# EAGLE schematic muscleSensor (EAGLE 7.2.0)
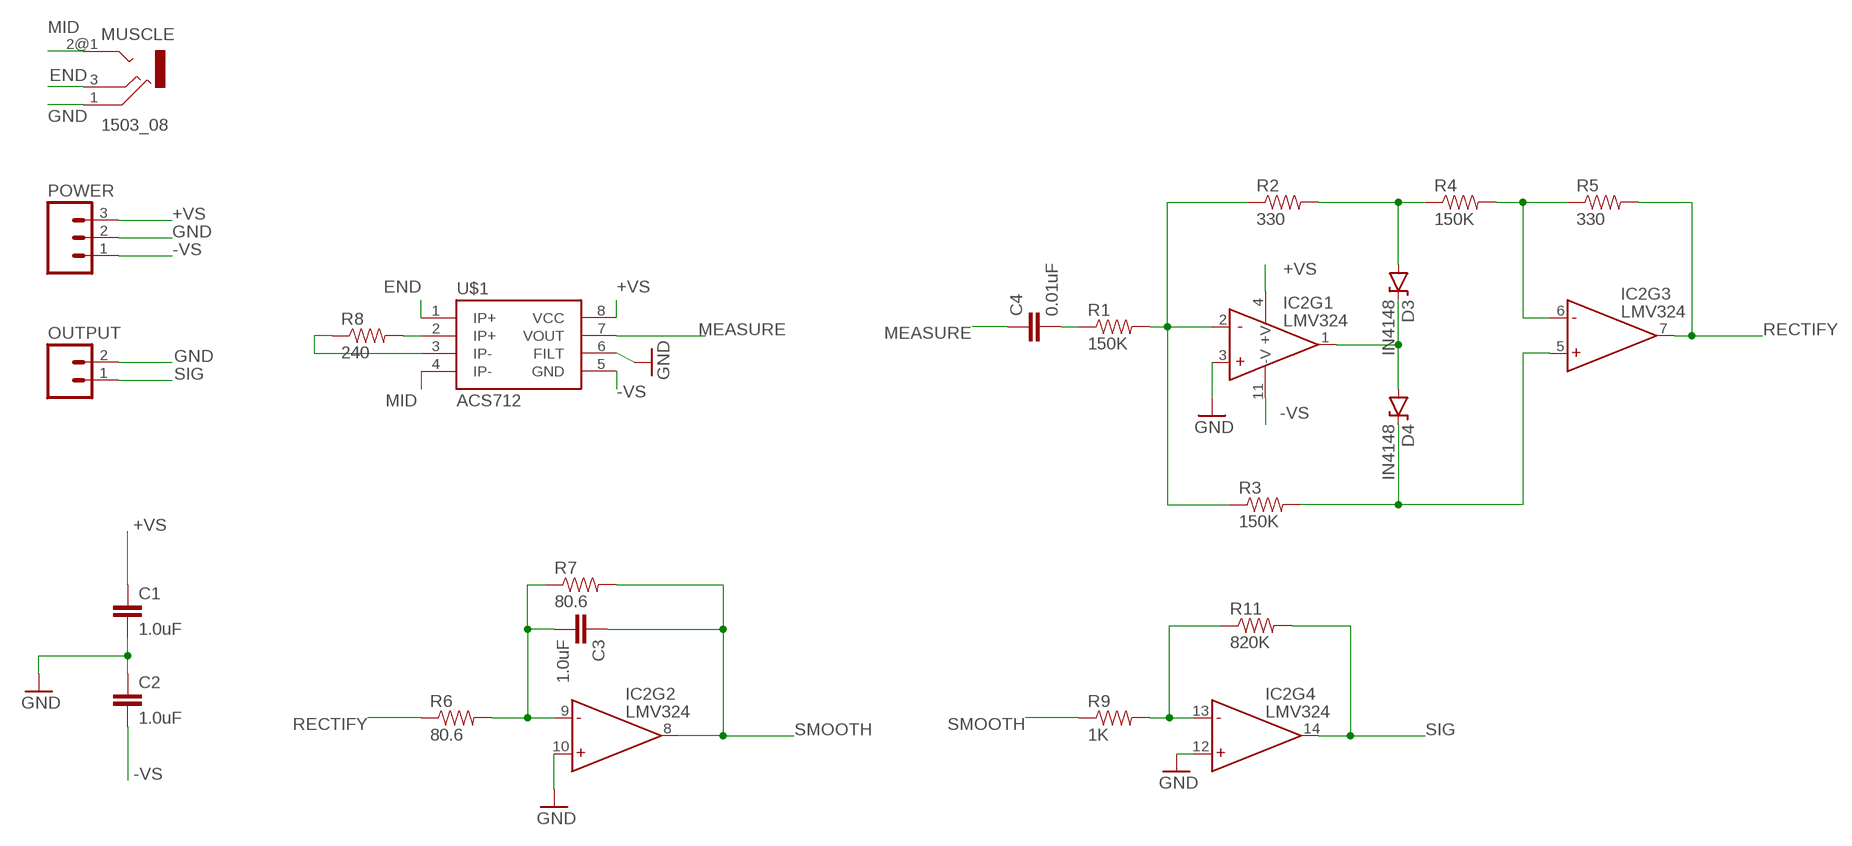
[diagram p0: schematic, sheet 1]

## Parts
C1  1.0uF  1.0UF-16V-10%(0603)  [0603-CAP]
C2  1.0uF  1.0UF-16V-10%(0603)  [0603-CAP]
C3  1.0uF  1.0UF-16V-10%(0603)  [0603-CAP]
C4  0.01uF  0.1UF-25V(+80/-20%)(0603)  [0603-CAP]
D3  IN4148  DIODE-ZENER16V  [SOD-123]
D4  IN4148  DIODE-ZENER16V  [SOD-123]
IC2  LMV324  [SO014]
MUSCLE  1503_08  [1503_08]
OUTPUT  M02LOCK_LONGPADS  [1X02_LOCK_LONGPADS]
POWER  M03LOCK_LONGPADS  [1X03_LOCK_LONGPADS]
R1  150K  150KOHM1/10W1%(0603)  [0603-RES]
R2  330  150KOHM1/10W1%(0603)  [0603-RES]
R3  150K  150KOHM1/10W1%(0603)  [0603-RES]
R4  150K  150KOHM1/10W1%(0603)  [0603-RES]
R5  330  150KOHM1/10W1%(0603)  [0603-RES]
R6  80.6  150KOHM1/10W1%(0603)  [0603-RES]
R7  80.6  150KOHM1/10W1%(0603)  [0603-RES]
R8  240  240OHM1/10W1%(0603)  [0603-RES]
R9  1K  1KOHM-1/10W-1%(0603)  [0603-RES]
R11  820K  150KOHM1/10W1%(0603)  [0603-RES]
U$1  ACS712  [SO08]

## Nets
+VS: C1.1 IC2.4(+V) POWER.3 U$1.8(VCC)
-VS: C2.2 IC2.11(-V) POWER.1 U$1.5(GND)
END: MUSCLE.3 U$1.1(IP+)
GND: C1.2 C2.1 IC2.3(+IN) IC2.10(+IN) IC2.12(+IN) MUSCLE.1 OUTPUT.2 POWER.2 U$1.6(FILT)
MEASURE: C4.1 U$1.7(VOUT)
MID: MUSCLE.2@1 U$1.4(IP-)
N$1: IC2.2(-IN) R1.2 R2.1 R3.1
N$2: C4.2 R1.1
N$4: D3.A R2.2 R4.1
N$5: IC2.6(-IN) R4.2 R5.1
N$6: R8.2 U$1.2(IP+)
N$7: R8.1 U$1.3(IP-)
N$8: D4.C IC2.5(+IN) R3.2
N$9: C3.2 IC2.9(-IN) R6.2 R7.1
N$10: IC2.13(-IN) R9.2 R11.1
N$11: D3.C D4.A IC2.1(OUT)
RECTIFY: IC2.7(OUT) R5.2 R6.1
SIG: IC2.14(OUT) OUTPUT.1 R11.2
SMOOTH: C3.1 IC2.8(OUT) R7.2 R9.1
Unconnected: MUSCLE.2@2

## Library data of the parts
C1-C3 = SparkFun-Capacitors:1.0UF-16V-10%(0603): CAP-00868; PROD_ID: CAP-00868
C4 = SparkFun-Capacitors:0.1UF-25V(+80/-20%)(0603): CAP-00810 Ceramic Standard decoupling cap; PROD_ID: CAP-00810; VALUE: 0.1uF
D3 D4 = SparkFun-DiscreteSemi:DIODE-ZENER: Zener Diode Production Part - 8199 3.4V Zener Voltage; PROD_ID: DIO-12440; VALUE: 16V
IC2 = SparkFun-AnalogIC:LMV324: Jellybean quad op-amp; PROD_ID: IC-08227
MUSCLE = con-lumberg:1503_?: Jack connectors according to JISC 6560, 3.5 mm Klinkensteckverbinder nach JISC 6560, 3,5 mm Source: http://www.lumberg.com/Produkte/PDFs/1503_08.pdf; OC_FARNELL: unknown; OC_NEWARK: unknown
OUTPUT = SparkFun-Connectors:M02: Standard 2-pin 0.1" header. Use with - straight break away headers ( PRT-00116) - right angle break away headers (PRT-00553) - swiss pins (PRT-00743) - machine pins (PRT-00117) - female headers (PRT-00115) Molex polarized connector foot print use with: PRT-08233 with associated crimp pins and housings. 2.54_SCREWTERM for use with PRT-10571. 3.5mm Screw Terminal footprints for PRT-08084 5mm Screw Terminal footprints for use with PRT-08432
POWER = SparkFun-Connectors:M03: Header 3 Standard 3-pin 0.1" header. Use with straight break away headers (SKU : PRT-00116), right angle break away headers (PRT-00553), swiss pins (PRT-00743), machine pins (PRT-00117), and female headers (PRT-00115). Molex polarized connector foot print use with SKU : PRT-08232 with associated crimp pins and housings.
R1-R7 R11 = SparkFun-Resistors:150KOHM1/10W1%(0603): RES-09117; PROD_ID: RES-09117
R8 = SparkFun-Resistors:240OHM1/10W1%(0603): RES-07849; PROD_ID: RES-07849
R9 = SparkFun-Resistors:1KOHM-1/10W-1%(0603): RES-07856; PROD_ID: RES-07856
U$1 = SparkFun-AnalogIC:ACS712: Hall-effect-based isolated linear current sensor